# Altium schematic sheet design_5.SchDoc: design
size 414 x 279 mm; Date: 1/25/2021 11:39:22 PM; SheetNumber: 6; Origin: Eagle; GateName_1: G$1; SymbolName_1: A3-L-GUMSTIX; LibraryName: qualified_1; DeviceSetName: A3-L-GUMSTIX; A: A; B: B; C: C; D: D; E: E; F: F; G: G; H: H; 1: 1; 2: 2; 3: 3; 4: 4; 5: 5; Sheet: Sheet:; C:/Gumstix/gumstix-logo-16.bmp: C:/Gumstix/gumstix-logo-16.bmp; Board: Board:
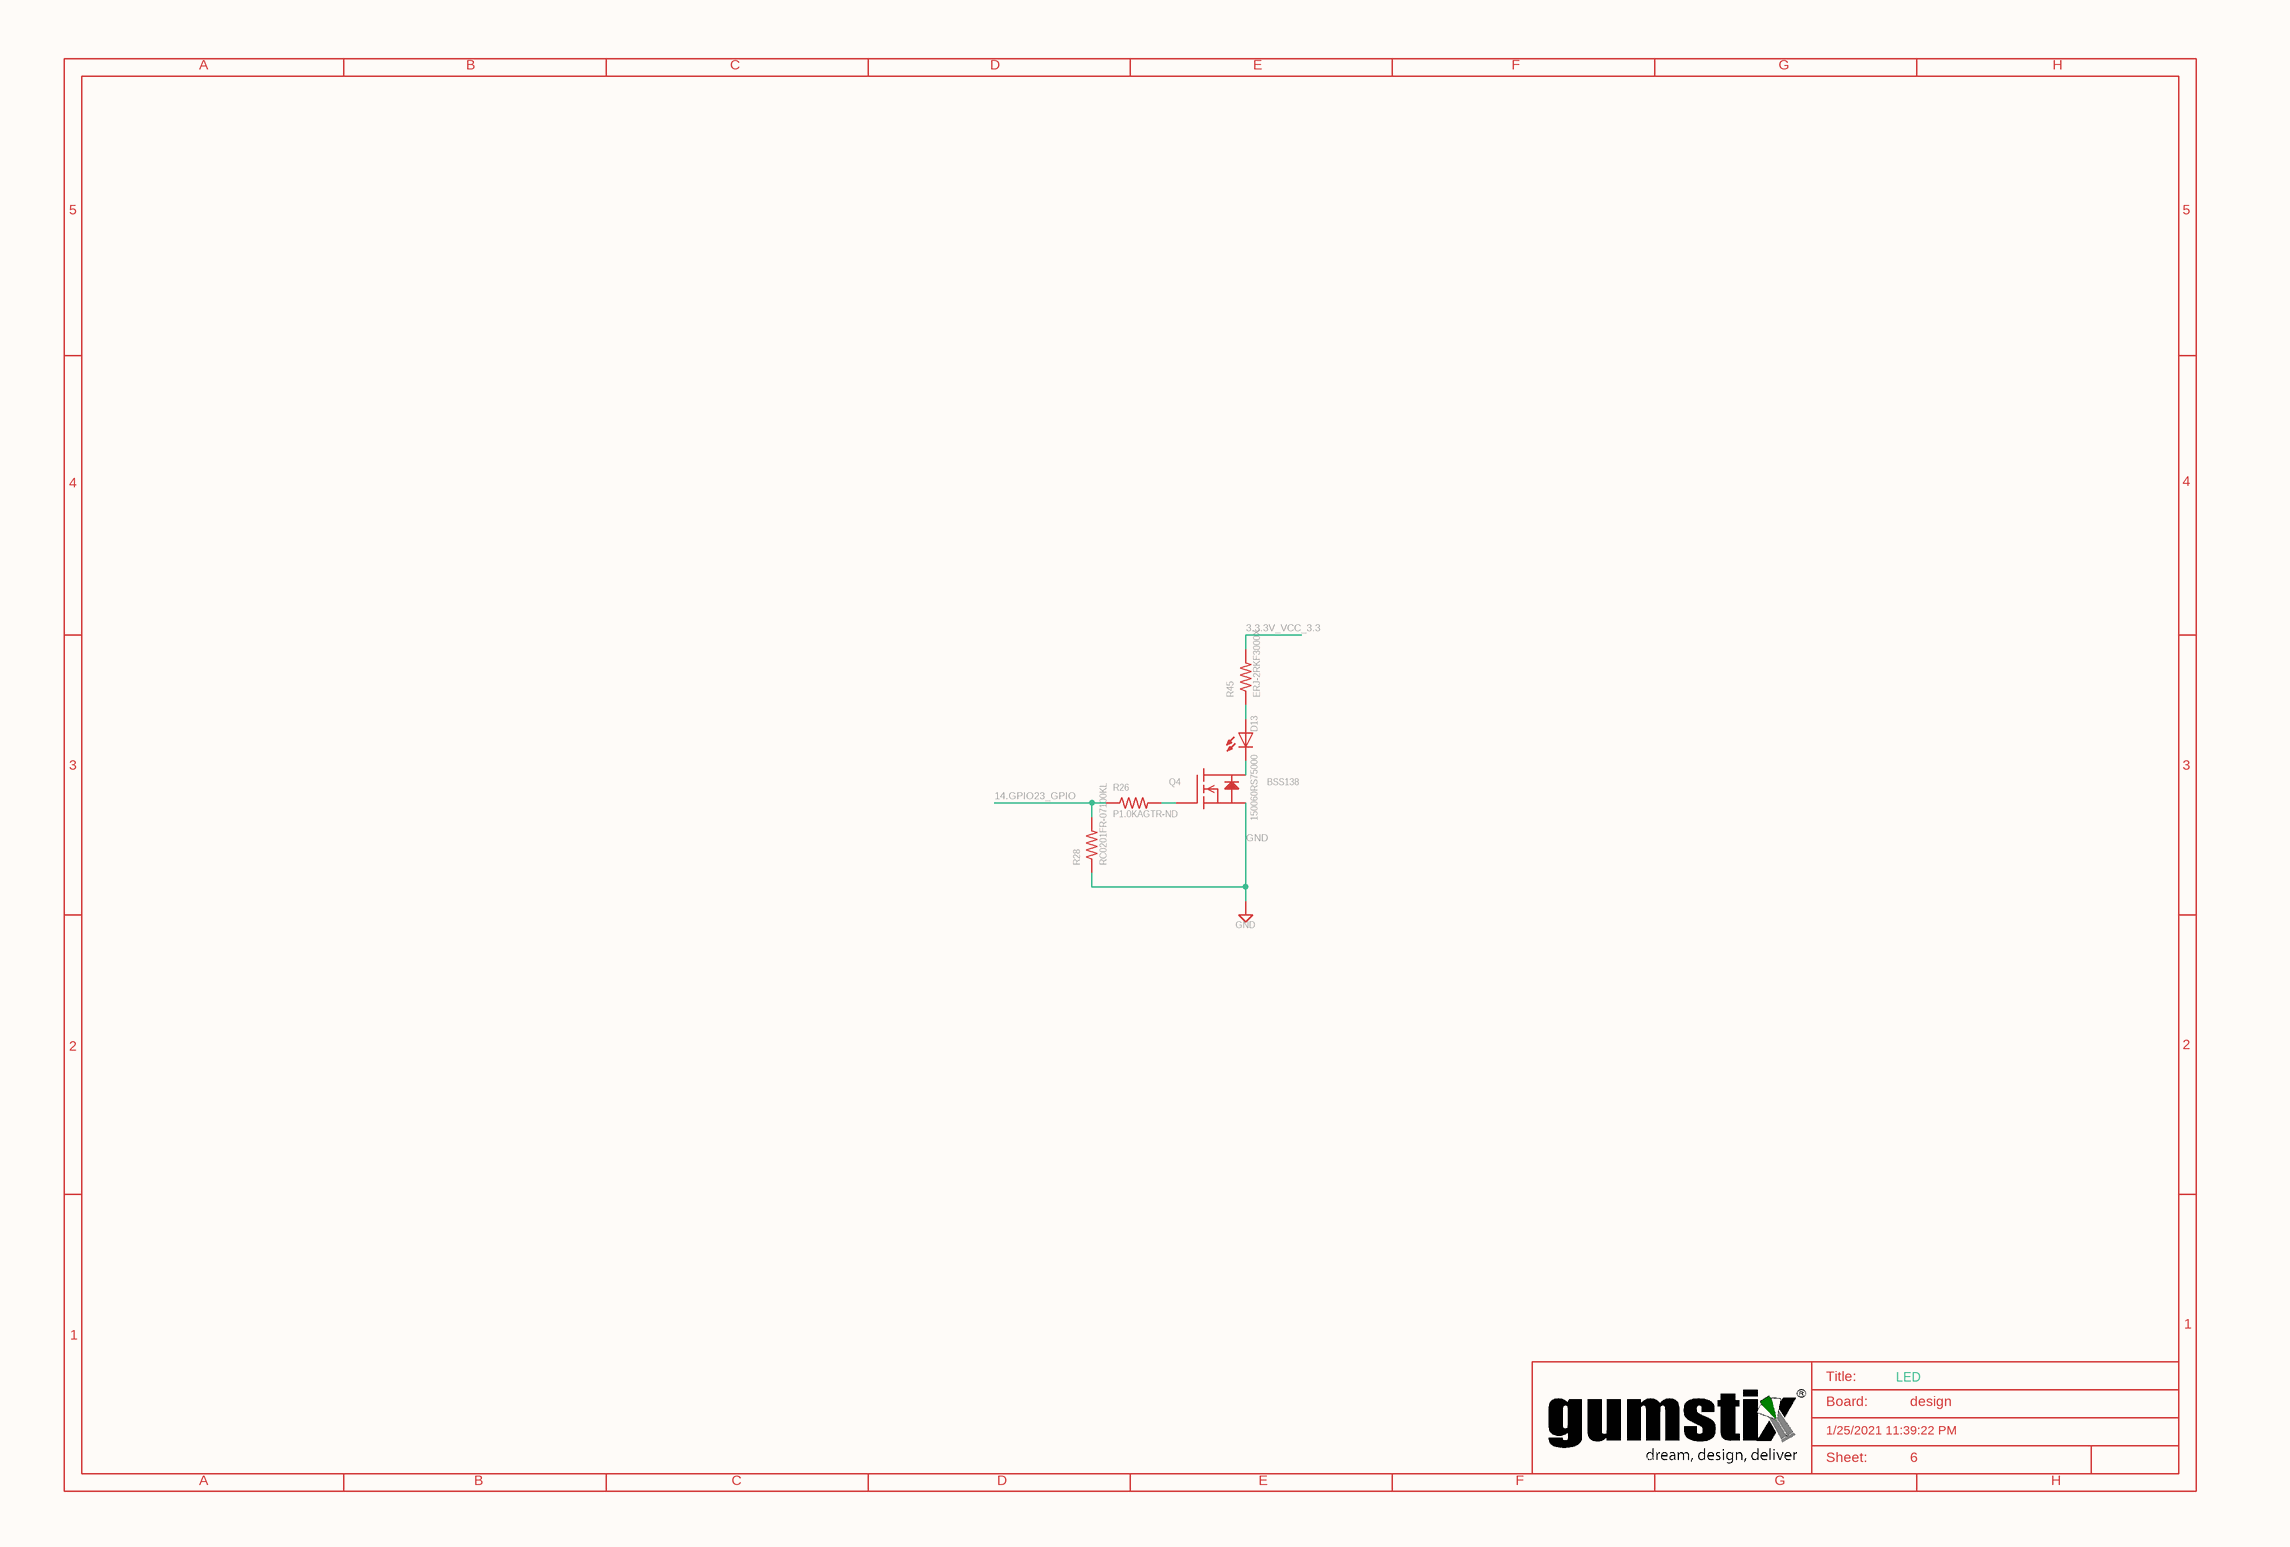
[diagram p0: design_5.SchDoc]

## Parts
D13  150060RS75000  [D0603]
Q4  BSS138  [SOT23]
R26  P1.0KAGTR-ND  [0201]
R28  RC0201FR-07100KL  [0201]
R45  ERJ-2RKF3000X  [0402]
SUPPLY95  GND

## Nets
3.3.3V_VCC_3.3: R45.2
14.GPIO23_GPIO: R26.1 R28.2
GND: Q4.2(S) R28.1 SUPPLY95.?1(GND)
NetD13_A: D13.A R45.1
NetD13_C: D13.C Q4.3(D)
NetQ4_1: Q4.1(G) R26.2

## Notes on the sheet
- A
- B
- C
- D
- E
- F
- G
- H
- 5
- 4
- 3
- 2
- 1
- Title:
- Board:
- LED
- design
- C:/Gumstix/gumstix-logo-16.bmp
- 1/25/2021 11:39:22 PM
- Sheet:
- 6

## Library data of the parts
D13 = 150060RS75000: GateName_1: G$1; SymbolName_1: LED; LibraryName: qualified_1; DeviceSetName: 150060RS75000; HEIGHT: 0.5
Q4 = BSS138: N-Channel Enhancement MOSFET; GateName_1: G$1; SymbolName_1: IGFET-EN-GDS; LibraryName: qualified_1; DeviceSetName: BSS138; HEIGHT: 1.12
R26 = P1.0KAGTR-ND: GateName_1: G$1; SymbolName_1: R-US; LibraryName: qualified_1; DeviceSetName: P1.0KAGTR-ND; HEIGHT: 0.25
R28 = RC0201FR-07100KL: GateName_1: G$1; SymbolName_1: R-US; LibraryName: qualified_1; DeviceSetName: RC0201FR-07100KL; HEIGHT: 0.25
R45 = ERJ-2RKF3000X: GateName_1: G$1; SymbolName_1: R-US; LibraryName: qualified_1; DeviceSetName: ERJ-2RKF3000X; HEIGHT: 0.35
SUPPLY95 = GND: SUPPLY SYMBOL; SymbolName_1: GND-2; GateName_1: GND; LibraryName: qualified_1; DeviceSetName: GND